# Altium schematic sheet MCU_adacus_sch.SchDoc
size B; SheetNumber: 2; SheetTotal: 4
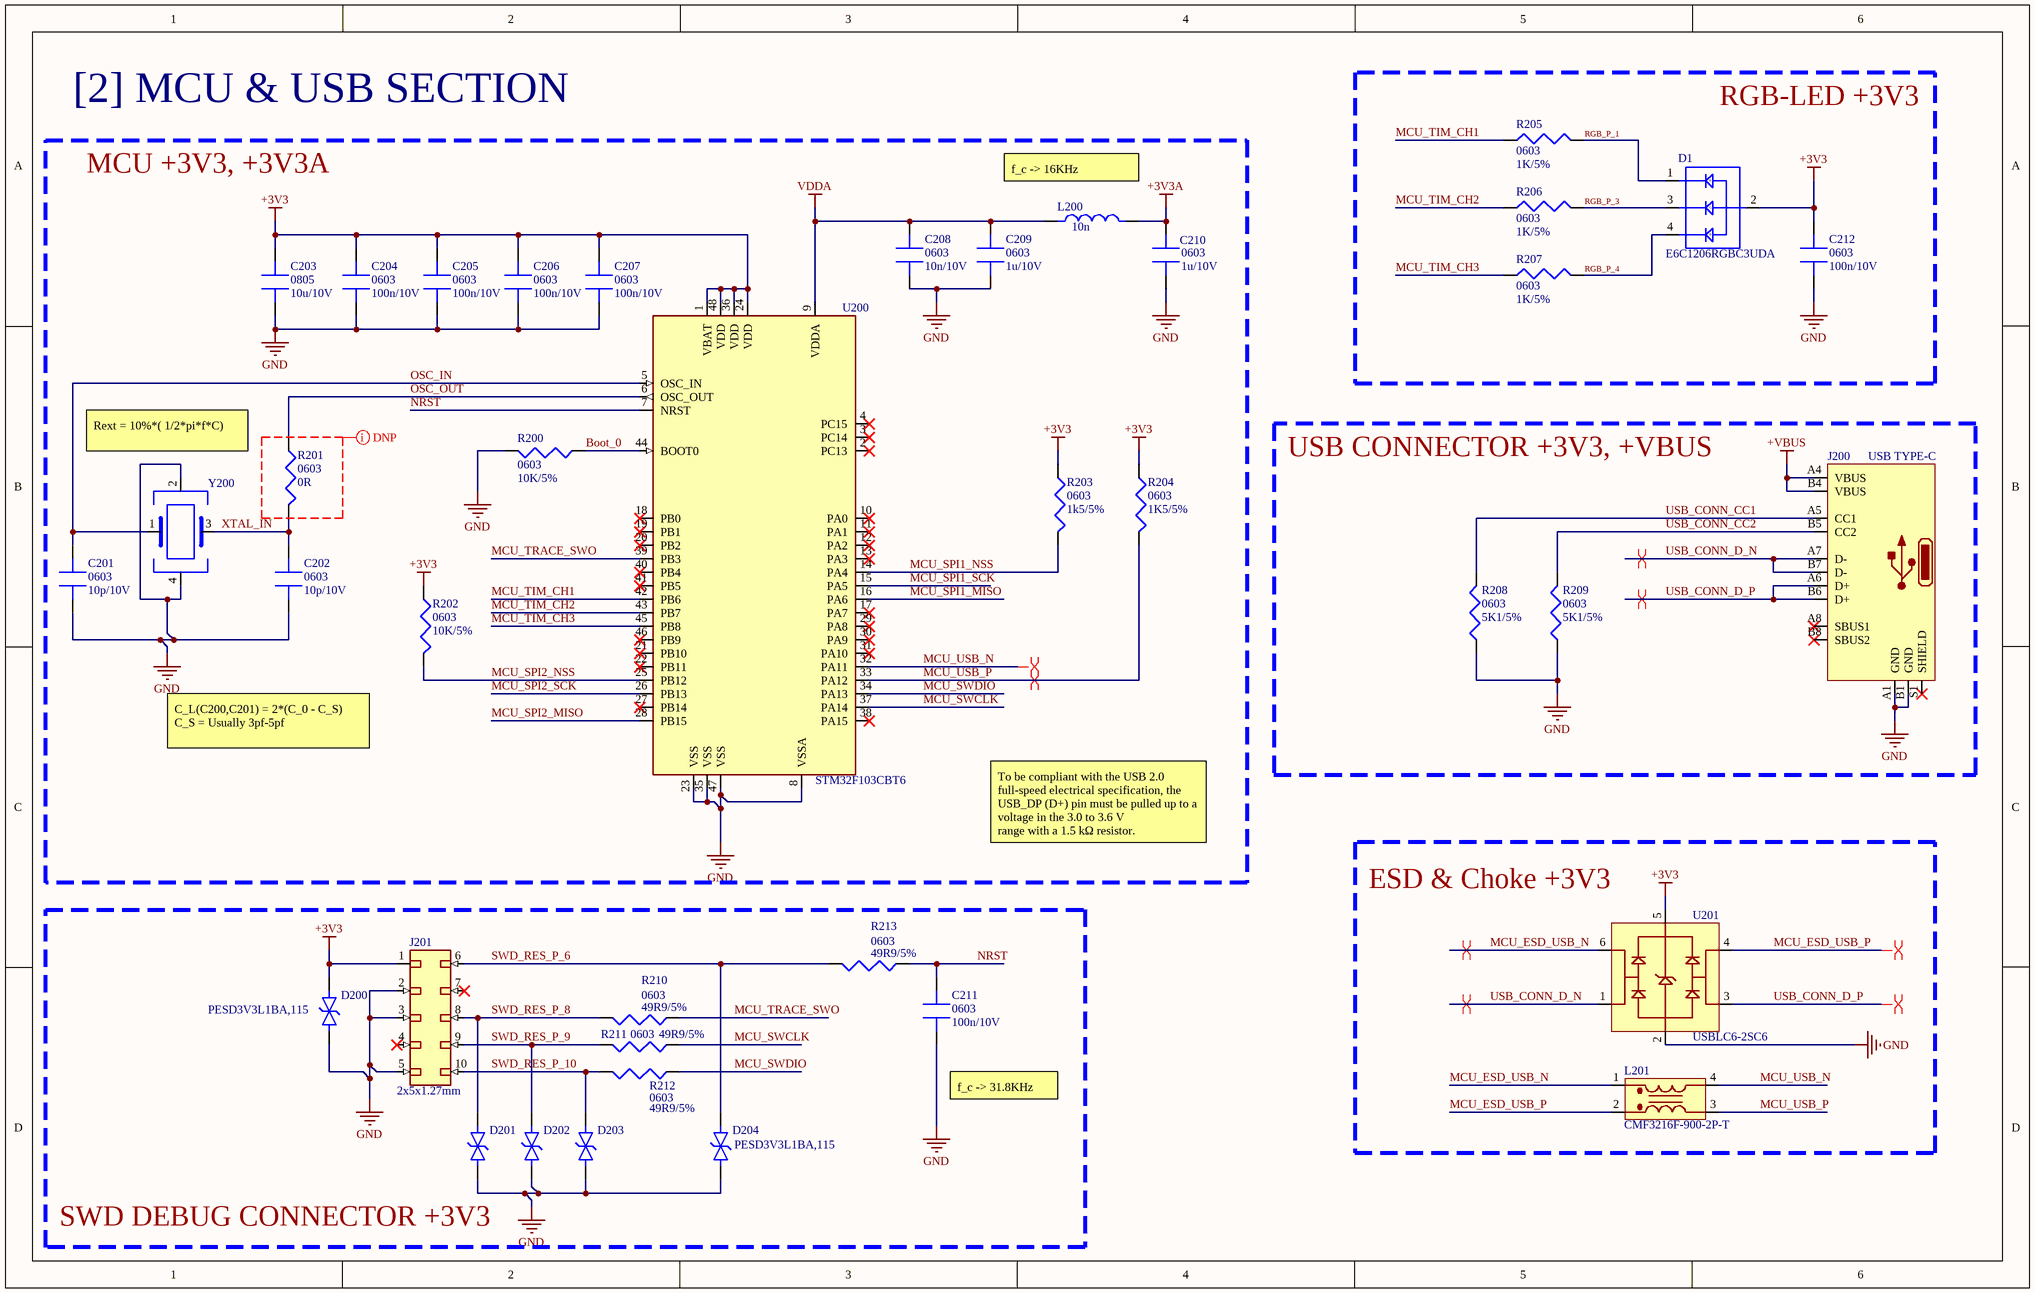
[diagram p0: MCU_adacus_sch.SchDoc]

## Parts
C201  value 10p/10V  Package: 0603  [[0603] CAPC1608X10M [A-LD]]  (hidden comment: Capacitor)
C202  value 10p/10V  Package: 0603  [[0603] CAPC1608X10M [A-LD]]  (hidden comment: Capacitor)
C203  value 10u/10V  Package: 0805  [[0805] CAPC2012X09M [A - LD]]  (hidden comment: Capacitor)
C204  value 100n/10V  Package: 0603  [[0603] CAPC1608X10M [A-LD]]  (hidden comment: Capacitor)
C205  value 100n/10V  Package: 0603  [[0603] CAPC1608X10M [A-LD]]  (hidden comment: Capacitor)
C206  value 100n/10V  Package: 0603  [[0603] CAPC1608X10M [A-LD]]  (hidden comment: Capacitor)
C207  value 100n/10V  Package: 0603  [[0603] CAPC1608X10M [A-LD]]  (hidden comment: Capacitor)
C208  value 10n/10V  Package: 0603  [[0603] CAPC1608X10M [A-LD]]  (hidden comment: Capacitor)
C209  value 1u/10V  Package: 0603  [[0603] CAPC1608X10M [A-LD]]  (hidden comment: Capacitor)
C210  value 1u/10V  Package: 0603  [[0603] CAPC1608X10M [A-LD]]  (hidden comment: Capacitor)
C211  value 100n/10V  Package: 0603  [[0603] CAPC1608X10M [A-LD]]  (hidden comment: Capacitor)
C212  value 100n/10V  Package: 0603  [[0603] CAPC1608X10M [A-LD]]  (hidden comment: Capacitor)
D1  E6C1206RGBC3UDA  [E6C1206RGBC3UDA]
D200  PESD3V3L1BA,115  [SODFL250X110-2M]
D201  PESD3V3L1BA,115  [SODFL250X110-2M]  (value not drawn)
D202  PESD3V3L1BA,115  [SODFL250X110-2M]  (value not drawn)
D203  PESD3V3L1BA,115  [SODFL250X110-2M]  (value not drawn)
D204  PESD3V3L1BA,115  [SODFL250X110-2M]
J200  USB TYPE-C  [HRO_TYPE-C-31-M-12]
J201  2x5x1.27mm  [2X10_BOXHEADER]
L200  value 10n  [PM0603-10NJ]  (hidden comment: Inductor)
L201  CMF3216F-900-2P-T  [CMF3216F-900-2P-T]
R200  value 10K/5%  Package: 0603  [[0603] RESC1608X06M [A-LD]]  (hidden comment: Resistor)
R201  value 0R  Package: 0603  [[0603] RESC1608X06M [A-LD]]  (hidden comment: Resistor)
R202  value 10K/5%  Package: 0603  [[0603] RESC1608X06M [A-LD]]  (hidden comment: Resistor)
R203  value 1k5/5%  Package: 0603  [[0603] RESC1608X06M [A-LD]]  (hidden comment: Resistor)
R204  value 1K5/5%  Package: 0603  [[0603] RESC1608X06M [A-LD]]  (hidden comment: Resistor)
R205  value 1K/5%  Package: 0603  [[0603] RESC1608X06M [A-LD]]  (hidden comment: Resistor)
R206  value 1K/5%  Package: 0603  [[0603] RESC1608X06M [A-LD]]  (hidden comment: Resistor)
R207  value 1K/5%  Package: 0603  [[0603] RESC1608X06M [A-LD]]  (hidden comment: Resistor)
R208  value 5K1/5%  Package: 0603  [[0603] RESC1608X06M [A-LD]]  (hidden comment: Resistor)
R209  value 5K1/5%  Package: 0603  [[0603] RESC1608X06M [A-LD]]  (hidden comment: Resistor)
R210  value 49R9/5%  Package: 0603  [[0603] RESC1608X06M [A-LD]]  (hidden comment: Resistor)
R211  value 49R9/5%  Package: 0603  [[0603] RESC1608X06M [A-LD]]  (hidden comment: Resistor)
R212  value 49R9/5%  Package: 0603  [[0603] RESC1608X06M [A-LD]]  (hidden comment: Resistor)
R213  value 49R9/5%  Package: 0603  [[0603] RESC1608X06M [A-LD]]  (hidden comment: Resistor)
U200  STM32F103CBT6  [TSQFP50P900X900X160-48M]
U201  USBLC6-2SC6  [SOT95P280X145-6M]
Y200  ECS-2016MV-160-DN  [ECS-2016MV-160-DN]  (value not drawn)

## Blocks framed on the sheet
RGB-LED +3V3: C212 D1 R205-R207
MCU +3V3, +3V3A: C201-C210 L200 R200-R204 U200 Y200
USB CONNECTOR +3V3, +VBUS: J200 R208 R209
ESD & Choke +3V3: L201 U201
SWD DEBUG CONNECTOR +3V3: C211 D200-D204 J201 R210-R213

## Nets
+3V3: C203.2 C204.2 C205.2 C206.2 C207.2 C212.2 D1.2 D200.2 J201.1(VCC) R202.2 R203.2 R204.2 U200.1(VBAT) U200.24(VDD) U200.36(VDD) U200.48(VDD) U201.5
+3V3A: C210.2 L200.1
+VBUS: J200.A4(VBUS) J200.B4(VBUS)
GND: C201.1 C202.1 C203.1 C204.1 C205.1 C206.1 C207.1 C208.1 C209.1 C210.1 C211.1 C212.1 D200.1 D201.1 D202.1 D203.1 D204.1 J200.A1(GND) J200.B1(GND) J201.2(TMS) J201.3(GND) J201.5(GND) R200.1 R208.2 R209.2 U200.8(VSSA) U200.23(VSS) U200.35(VSS) U200.47(VSS) U201.2 Y200.2 Y200.4
VDDA: C208.2 C209.2 L200.2 U200.9(VDDA)
Boot_0: R200.2 U200.44(BOOT0)
MCU_ESD_USB_N: L201.1 U201.6
MCU_ESD_USB_P: L201.2 U201.4
MCU_SPI1_MISO: U200.16(PA6)
MCU_SPI1_NSS: R203.1 U200.14(PA4)
MCU_SPI1_SCK: U200.15(PA5)
MCU_SPI2_MISO: U200.28(PB15)
MCU_SPI2_NSS: R202.1 U200.25(PB12)
MCU_SPI2_SCK: U200.26(PB13)
MCU_SWCLK: R211.2 U200.37(PA14)
MCU_SWDIO: R212.2 U200.34(PA13)
MCU_TIM_CH1: R205.2 U200.42(PB6)
MCU_TIM_CH2: R206.2 U200.43(PB7)
MCU_TIM_CH3: R207.2 U200.45(PB8)
MCU_TRACE_SWO: R210.2 U200.39(PB3)
MCU_USB_N: L201.4 U200.32(PA11)
MCU_USB_P: L201.3 R204.1 U200.33(PA12)
NRST: C211.2 R213.2 U200.7(NRST)
OSC_IN: C201.2 U200.5(OSC_IN) Y200.1
OSC_OUT: R201.2 U200.6(OSC_OUT)
RGB_P_1: D1.1 R205.1
RGB_P_3: D1.3 R206.1
RGB_P_4: D1.4 R207.1
SWD_RES_P_6: D204.2 J201.6(TDO) R213.1
SWD_RES_P_8: D201.2 J201.8(TDI) R210.1
SWD_RES_P_9: D202.2 J201.9(GND) R211.1
SWD_RES_P_10: D203.2 J201.10(nRESET) R212.1
USB_CONN_CC1: J200.A5(CC1) R208.1
USB_CONN_CC2: J200.B5(CC2) R209.1
USB_CONN_D_N: J200.A7(D-) J200.B7(D-) U201.1
USB_CONN_D_P: J200.A6(D+) J200.B6(D+) U201.3
XTAL_IN: C202.2 R201.1 Y200.3

Not connected (* = marked no-connect by the designer): J200 A8(SBUS1)* B8(SBUS2)* S1(SHIELD)*; J201 4(TCK)* 7(KEY)*; U200 2(PC13)* 3(PC14)* 4(PC15)* 10(PA0)* 11(PA1)* 12(PA2)* 13(PA3)* 17(PA7)* 18(PB0)* 19(PB1)* 20(PB2)* 21(PB10)* 22(PB11)* 27(PB14)* 29(PA8)* 30(PA9)* 31(PA10)* 38(PA15)* 40(PB4)* 41(PB5)* 46(PB9)*

## Layout directives
differential pair: MCU_ESD_USB_N, MCU_ESD_USB_P, MCU_USB_N, MCU_USB_P, USB_CONN_D_N, USB_CONN_D_P
mark named DNP: (no net found under the mark)

## Notes on the sheet
- [2] MCU & USB SECTION
- f_c -> 16KHz
- Rext = 10%*( 1/2*pi*f*C)
- C_L(C200,C201) = 2*(C_0 - C_S)                                C_S = Usually 3pf-5pf
- To be compliant with the USB 2.0 full-speed electrical specification, the USB_DP (D+) pin must be pulled up to a voltage in the 3.0 to 3.6 V
  range with a 1.5 kΩ resistor.
- (near C211) f_c -> 31.8KHz
- (in symbol LED_RGB) R; G; B

## Library data of the parts
C201-C212 = Capacitor: Standard Capacitor
D1 = LED_RGB: RGB 1206 Light Emitting Diodes (LED) ROHS; Supplier Link: https://www.lcsc.com/product-detail/Light-Emitting-Diodes-LED_EKINGLUX-E6C1206RGBC3UDA_C375571.html; Datasheet: https://datasheet.lcsc.com/lcsc/2203301730_EKINGLUX-E6C1206RGBC3UDA_C375571.pdf
D200-D204 = PESD3V3L1BA,115: ESD Suppressors / TVS Diodes PESD3V3L1BA/SOD323/SOD2; Supplier Link: https://www.mouser.pl/ProductDetail/Nexperia/PESD3V3L1BA115?qs=LOCUfHb8d9tfcQwAsqvzKg%3D%3D; Datasheet: https://www.mouser.pl/datasheet/2/916/PESD3V3L1BA-3162553.pdf
J201 = SWD Connector: SWD Connector 2x5x1.27mm pin count
L200 = Inductor: Standard Inductor
L201 = CMF3216F-900-2P-T: 90Ω@100MHz 0.3Ω 2 1206 Common Mode Filters ROHS; Supplier Link: https://www.lcsc.com/product-detail/Common-Mode-Filters_HYHONGYEX-CMF3216F-900-2P-T_C963740.html; Datasheet: https://datasheet.lcsc.com/lcsc/2304140030_HYHONGYEX-CMF3216F-900-2P-T_C963740.pdf
R200-R213 = Resistor: Standard Resistor
U200 = STM32F103CBT6: ARM Microcontrollers - MCU 32BIT Cortex M3 128K MED Performance LN; Datasheet: https://www.mouser.pl/datasheet/2/389/stm32f103c8-1851025.pdf; Supplier Link: https://www.mouser.pl/ProductDetail/STMicroelectronics/STM32F103CBT6?qs=WxFF5lh7QM3goh6GV5Ogig%3D%3D&_gl=1*1oo9tks*_ga*dW5kZWZpbmVk*_ga_15W4STQT4T*dW5kZWZpbmVk*_ga_1KQLCYKRX3*dW5kZWZpbmVk
U201 = USBLC6-2: Very low capacitance ESD protection; Datasheet: https://www.mouser.pl/datasheet/2/389/usblc6_2-1852789.pdf; Supplier Link: https://www.mouser.pl/ProductDetail/STMicroelectronics/USBLC6-2SC6?qs=po45yt2pPpu%2FhNIlwQdTlg%3D%3D
Y200 = ECS-2016MV-160-DN: Standard Clock Oscillators 16.000 MHz Standby CMOS Multi-Volt 1.6 - 3.6 V +/-20ppm -40 - 85C 4-SMD 2.0 x 1.6mm